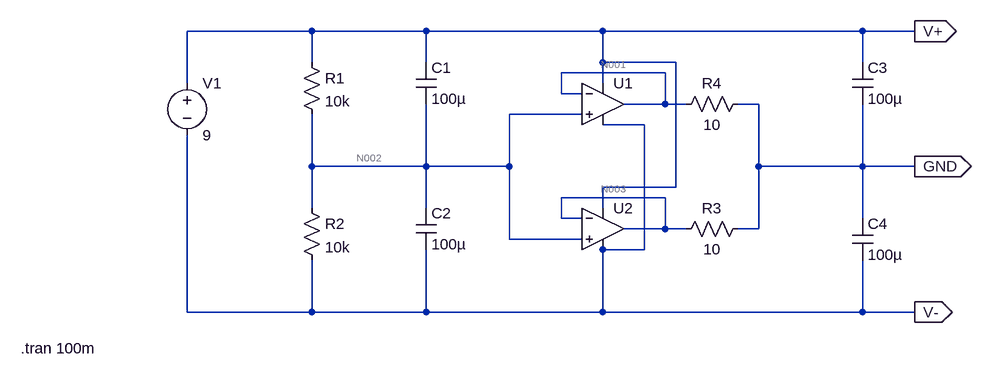
[diagram p0: schematic SupplySplit.asc]
SupplySplit.asc, the LTspice schematic file:
Version 4
SHEET 1 1312 680
WIRE 272 96 80 96
WIRE 448 96 272 96
WIRE 720 96 448 96
WIRE 1120 96 720 96
WIRE 1200 96 1120 96
WIRE 272 144 272 96
WIRE 448 144 448 96
WIRE 720 144 720 96
WIRE 832 144 720 144
WIRE 1120 144 1120 96
WIRE 816 160 656 160
WIRE 80 176 80 96
WIRE 720 176 720 144
WIRE 656 192 656 160
WIRE 688 192 656 192
WIRE 816 208 816 160
WIRE 816 208 752 208
WIRE 848 208 816 208
WIRE 960 208 928 208
WIRE 688 224 576 224
WIRE 784 240 720 240
WIRE 272 304 272 224
WIRE 448 304 448 208
WIRE 448 304 272 304
WIRE 576 304 576 224
WIRE 576 304 448 304
WIRE 960 304 960 208
WIRE 1120 304 1120 208
WIRE 1120 304 960 304
WIRE 1200 304 1120 304
WIRE 832 336 832 144
WIRE 832 336 720 336
WIRE 816 352 656 352
WIRE 272 368 272 304
WIRE 448 368 448 304
WIRE 720 368 720 336
WIRE 656 384 656 352
WIRE 688 384 656 384
WIRE 1120 384 1120 304
WIRE 816 400 816 352
WIRE 816 400 752 400
WIRE 848 400 816 400
WIRE 960 400 960 304
WIRE 960 400 928 400
WIRE 576 416 576 304
WIRE 688 416 576 416
WIRE 784 432 784 240
WIRE 784 432 720 432
WIRE 80 528 80 256
WIRE 272 528 272 448
WIRE 272 528 80 528
WIRE 448 528 448 432
WIRE 448 528 272 528
WIRE 720 528 720 432
WIRE 720 528 448 528
WIRE 1120 528 1120 448
WIRE 1120 528 720 528
WIRE 1200 528 1120 528
FLAG 1200 96 V+
IOPIN 1200 96 Out
FLAG 1200 528 V-
IOPIN 1200 528 Out
FLAG 1200 304 GND
IOPIN 1200 304 Out
SYMBOL voltage 80 160 R0
WINDOW 123 0 0 Left 0
WINDOW 39 0 0 Left 0
SYMATTR InstName V1
SYMATTR Value 9
SYMBOL res 256 128 R0
SYMATTR InstName R1
SYMATTR Value 10k
SYMBOL res 256 352 R0
SYMATTR InstName R2
SYMATTR Value 10k
SYMBOL cap 432 144 R0
SYMATTR InstName C1
SYMATTR Value 100µ
SYMBOL cap 432 368 R0
SYMATTR InstName C2
SYMATTR Value 100µ
SYMBOL OpAmps\\UniversalOpAmp 720 208 R0
SYMATTR InstName U1
SYMBOL OpAmps\\UniversalOpAmp 720 400 R0
SYMATTR InstName U2
SYMBOL res 944 384 R90
WINDOW 0 0 56 VBottom 2
WINDOW 3 32 56 VTop 2
SYMATTR InstName R3
SYMATTR Value 10
SYMBOL res 944 192 R90
WINDOW 0 0 56 VBottom 2
WINDOW 3 32 56 VTop 2
SYMATTR InstName R4
SYMATTR Value 10
SYMBOL cap 1104 144 R0
SYMATTR InstName C3
SYMATTR Value 100µ
SYMBOL cap 1104 384 R0
SYMATTR InstName C4
SYMATTR Value 100µ
TEXT -176 584 Left 2 !.tran 100m

The netlist it stands for:
* SupplySplit.asc
V1 V+ V- 9
R1 V+ N002 10k
R2 N002 V- 10k
C1 V+ N002 100µ
C2 N002 V- 100µ
XU1 N002 N001 V+ V- N001 level1 Avol=1Meg GBW=10Meg Vos=0 En=0 Enk=0 In=0 Ink=0 Rin=500Meg  ; pins In+ In- V+ V- OUT
XU2 N002 N003 V+ V- N003 level1 Avol=1Meg GBW=10Meg Vos=0 En=0 Enk=0 In=0 Ink=0 Rin=500Meg  ; pins In+ In- V+ V- OUT
R3 GND N003 10
R4 GND N001 10
C3 V+ GND 100µ
C4 GND V- 100µ
.tran 100m
.lib UniversalOpAmp1.lib
.backanno
.end

* Results of the author's LTspice run, read from the files saved beside the schematic
* Operating Point, zero values left out:
*   V(v+) = 4.5 V
*   V(v-) = -4.5 V
*   V(n002) = 6.393 µV
*   V(n001) = 6.393 µV
*   V(n003) = 6.393 µV
*   I(R1) = 450 µA
*   I(R2) = 450 µA
*   I(R3) = -639.3 nA
*   I(R4) = -639.3 nA
*   I(V1) = -450 µA
*   Ix(u1:3) = 9 nA
*   Ix(u1:4) = -9 nA
*   Ix(u1:5) = -640.7 nA
*   Ix(u2:3) = 9 nA
*   Ix(u2:4) = -9 nA
*   Ix(u2:5) = -640.7 nA